# Altium schematic sheet compute module microsd.SchDoc: Compute Module MicroSD
size A4; Organization: Blinkinlabs, LLC; DocumentNumber: 6; SheetNumber: 6; SheetTotal: 14
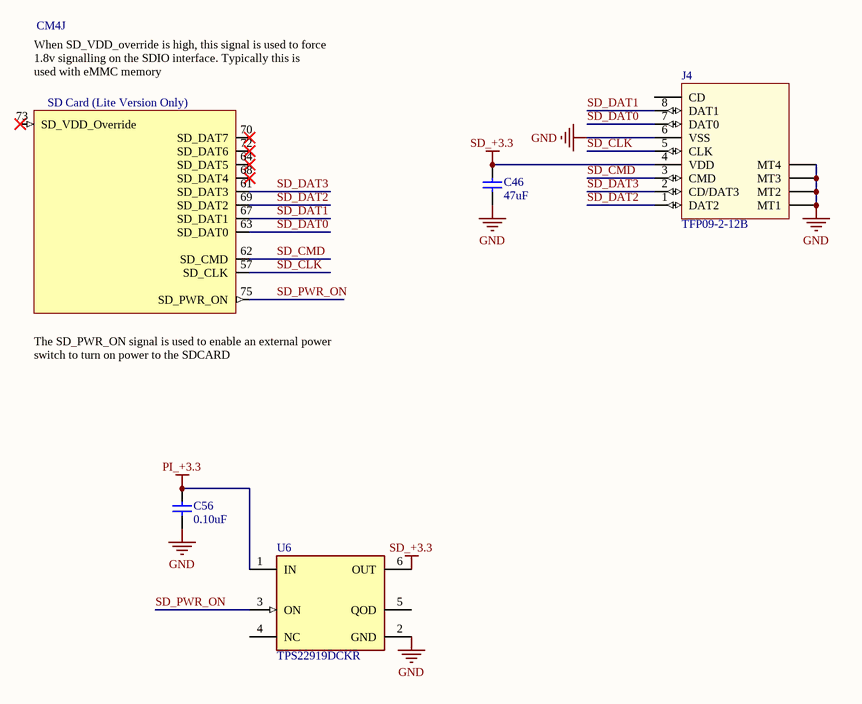
[diagram p0: compute module microsd.SchDoc]

## Parts
C46  47uF  [CAPC1608X09L]
C56  0.10uF  [CAPC1005X06L]
CM4  Raspberry Pi Compute Module 4  [CM4-F40C-100DS-0.4v_1.5mm_0mm]  (value not drawn)  (part J of 21)
J4  TFP09-2-12B  [TFP09-2-12B]
U6  TPS22919DCKR  [FP-DCK0006A-MFG]

## Nets
GND: C46.2 C56.1 J4.6(VSS) J4.MT1 J4.MT2 J4.MT3 J4.MT4 U6.2(GND)
PI_+3.3: C56.2 U6.1(IN)
SD_+3.3: C46.1 J4.4(VDD) U6.6(OUT)
SD_CLK: CM4.57(SD_CLK) J4.5(CLK)
SD_CMD: CM4.62(SD_CMD) J4.3(CMD)
SD_DAT0: CM4.63(SD_DAT0) J4.7(DAT0)
SD_DAT1: CM4.67(SD_DAT1) J4.8(DAT1)
SD_DAT2: CM4.69(SD_DAT2) J4.1(DAT2)
SD_DAT3: CM4.61(SD_DAT3) J4.2(CD/DAT3)
SD_PWR_ON: CM4.75(SD_PWR_ON) U6.3(ON)

Not connected (* = marked no-connect by the designer): CM4 64(SD_DAT5)* 68(SD_DAT4)* 70(SD_DAT7)* 72(SD_DAT6)* 73(SD_VDD_Override)*; J4 CD; U6 4(NC) 5(QOD)

## Notes on the sheet
- Title:
- Project:
- Revision:
- Date:
- Time:
- Sheet
- of
- (in symbol CM4, part J) When SD_VDD_override is high, this signal is used to force 1.8v signalling on the SDIO interface. Typically this is / used with eMMC memory; SD Card (Lite Version Only); by Amornthep Phunsin; The SD_PWR_ON signal is used to enable an external power switch to turn on power to the SDCARD

## Library data of the parts
C46 = ZRB18AR60J476ME01L: CAP CER 47UF 6.3V X5R 0603; Manufacturer: Murata Electronics North America; Tolerance: ±20%; PartNumber: ZRB18AR60J476ME01L; Datasheets: http://psearch.en.murata.com/capacitor/product/ZRB18AR60J476ME01%23.pdf; Image: //media.digikey.com/Renders/Murata%20Renders/ZRB-SERIES-0603.jpg; Digi-Key Part Number: 490-13255-1-ND; Series: ZRB; Value: 47uF; Voltage: 6.3V; Temperature Coefficient: X5R; Operating Temperature: -55°C ~ 85°C; Features: Derating Recommended, Interposer Termination; Applications: Acoustic Noise Reduction; Package / Case: 0603 (1608 Metric); Case/Package: 0603
C56 = GRM155R61A104KA01D: CAP CER 0.1UF 10V X5R 0402; Manufacturer: Murata Electronics North America; Tolerance: ±10%; PartNumber: GRM155R61A104KA01D; Datasheets: http://www.murata.com/~/media/webrenewal/support/library/catalog/products/capacitor/mlcc/c02e.pdf; Image: //media.digikey.com/Renders/Murata%20Renders/ZRB-SERIES-0402.jpg; Digi-Key Part Number: 490-1318-1-ND; Packaging: Cut Tape (CT); Series: GRM; Value: 0.10uF; Voltage: 10V; Temperature Coefficient: X5R; Operating Temperature: -55°C ~ 85°C; Features: -; Applications: General Purpose; Package / Case: 0402 (1005 Metric); Case/Package: 0402
CM4 = CM4: Raspberry Pi Compute Module 4 by Amornthep Phunsin
J4 = TFP09-2-12B: Micro SD Card Connector; Manufacturer: Unknown/Generic; PartNumber: TFP09-2-12B
U6 = CMP-04912-000027-1: POWER MANAGEMENT